# EAGLE design femto (EAGLE 6.4)
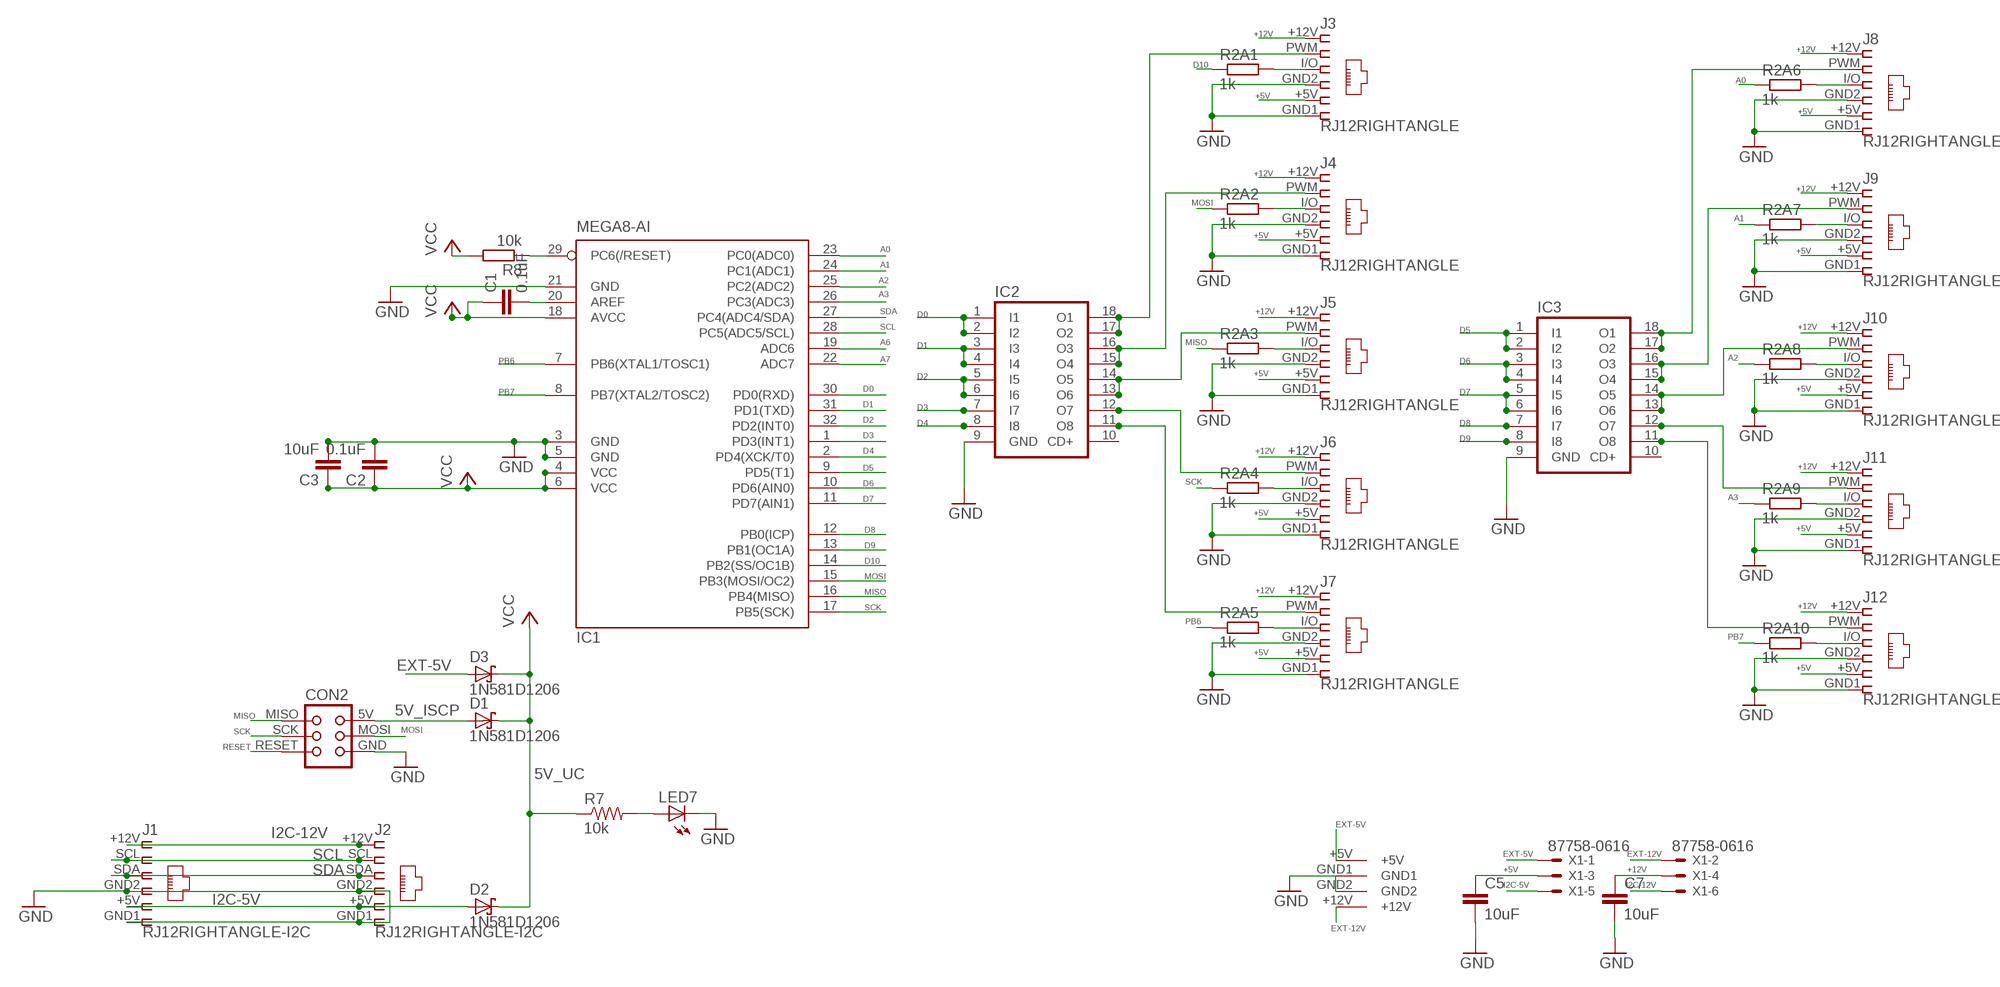
[diagram p0: schematic, sheet 1]

## Parts
C1  0.1uF  C-EUC1206  [C1206]
C2  0.1uF  C-EUC1206  [C1206]
C3  10uF  C-EUC1206  [C1206]
C5  10uF  C-EUC1206  [C1206]
C7  10uF  C-EUC1206  [C1206]
CON2  TINYISPTAG  [TC2030-MCP]
D1  1N581D1206  [LED-1206]
D2  1N581D1206  [LED-1206]
D3  1N581D1206  [LED-1206]
IC1  MEGA8-AI  [TQFP32-08]
IC2  ULN2803A  [SO18W]
IC3  ULN2803A  [SO18W]
J1  RJ12RIGHTANGLE-I2C  [RJ12-RIGHTANGLE-I2C]
J2  RJ12RIGHTANGLE-I2C  [RJ12-RIGHTANGLE-I2C]
J3  RJ12RIGHTANGLE  [RJ12-RIGHTANGLE]
J4  RJ12RIGHTANGLE  [RJ12-RIGHTANGLE]
J5  RJ12RIGHTANGLE  [RJ12-RIGHTANGLE]
J6  RJ12RIGHTANGLE  [RJ12-RIGHTANGLE]
J7  RJ12RIGHTANGLE  [RJ12-RIGHTANGLE]
J8  RJ12RIGHTANGLE  [RJ12-RIGHTANGLE]
J9  RJ12RIGHTANGLE  [RJ12-RIGHTANGLE]
J10  RJ12RIGHTANGLE  [RJ12-RIGHTANGLE]
J11  RJ12RIGHTANGLE  [RJ12-RIGHTANGLE]
J12  RJ12RIGHTANGLE  [RJ12-RIGHTANGLE]
LED7  LEDCHIP-LED0603  [CHIP-LED0603]
R2A1  1k  R-EU_M1206  [M1206]
R2A2  1k  R-EU_M1206  [M1206]
R2A3  1k  R-EU_M1206  [M1206]
R2A4  1k  R-EU_M1206  [M1206]
R2A5  1k  R-EU_M1206  [M1206]
R2A6  1k  R-EU_M1206  [M1206]
R2A7  1k  R-EU_M1206  [M1206]
R2A8  1k  R-EU_M1206  [M1206]
R2A9  1k  R-EU_M1206  [M1206]
R2A10  1k  R-EU_M1206  [M1206]
R7  10k  RESISTOR0603-RES  [0603-RES]
R8  10k  R-EU_M1206  [M1206]
U$1  KPJX-4S-S  [KPJX-4S-S]
X1  87758-0616  [87758-0616]

## Nets
5V_ISCP: CON2.5V(VCC) D1.A
5V_UC [power]: C1.1 C2.1 C3.1 D1.C D2.C D3.C IC1.4(VCC) IC1.6(VCC) IC1.18(AVCC) R7.1 R8.2 ; supply symbol labelled VCC
+5V [power]: C5.1 J3.+5V J4.+5V J5.+5V J6.+5V J7.+5V J8.+5V J9.+5V J10.+5V J11.+5V J12.+5V X1.3
+12V: C7.1 J3.+12V J4.+12V J5.+12V J6.+12V J7.+12V J8.+12V J9.+12V J10.+12V J11.+12V J12.+12V X1.4
A0: IC1.23(PC0(ADC0)) R2A6.1
A1: IC1.24(PC1(ADC1)) R2A7.1
A2: IC1.25(PC2(ADC2)) R2A8.1
A3: IC1.26(PC3(ADC3)) R2A9.1
A6: IC1.19(ADC6)
A7: IC1.22(ADC7)
D0: IC1.30(PD0(RXD)) IC2.1(I1) IC2.2(I2)
D1: IC1.31(PD1(TXD)) IC2.3(I3) IC2.4(I4)
D2: IC1.32(PD2(INT0)) IC2.5(I5) IC2.6(I6)
D3: IC1.1(PD3(INT1)) IC2.7(I7)
D4: IC1.2(PD4(XCK/T0)) IC2.8(I8)
D5: IC1.9(PD5(T1)) IC3.1(I1) IC3.2(I2)
D6: IC1.10(PD6(AIN0)) IC3.3(I3) IC3.4(I4)
D7: IC1.11(PD7(AIN1)) IC3.5(I5) IC3.6(I6)
D8: IC1.12(PB0(ICP)) IC3.7(I7)
D9: IC1.13(PB1(OC1A)) IC3.8(I8)
D10: IC1.14(PB2(SS/OC1B)) R2A1.1
EXT-5V [highpower]: D3.A U$1.+5V X1.1
EXT-12V [highpower]: U$1.+12V X1.2
GND [power]: C2.2 C3.2 C5.2 C7.2 CON2.GND IC1.3(GND) IC1.5(GND) IC1.21(GND) IC2.9(GND) IC3.9(GND) J1.GND1 J1.GND2 J2.GND1 J2.GND2 J3.GND1 J3.GND2 J4.GND1 J4.GND2 J5.GND1 J5.GND2 J6.GND1 J6.GND2 J7.GND1 J7.GND2 J8.GND1 J8.GND2 J9.GND1 J9.GND2 J10.GND1 J10.GND2 J11.GND1 J11.GND2 J12.GND1 J12.GND2 LED7.C U$1.GND1 U$1.GND2
I2C-5V [power]: D2.A J1.+5V J2.+5V X1.5
I2C-12V: J1.+12V J2.+12V X1.6
MISO: CON2.MISO IC1.16(PB4(MISO)) R2A3.1
MOSI: CON2.MOSI IC1.15(PB3(MOSI/OC2)) R2A2.1
N$2: J3.I/O R2A1.2
N$3: IC2.17(O2) IC2.18(O1) J3.PWM
N$4: C1.2 IC1.20(AREF)
N$5: IC2.15(O4) IC2.16(O3) J4.PWM
N$6: IC2.13(O6) IC2.14(O5) J5.PWM
N$9: J4.I/O R2A2.2
N$10: J5.I/O R2A3.2
N$11: IC2.12(O7) J6.PWM
N$12: J6.I/O R2A4.2
N$13: IC2.11(O8) J7.PWM
N$14: J7.I/O R2A5.2
N$15: LED7.A R7.2
N$18: IC3.17(O2) IC3.18(O1) J8.PWM
N$19: IC3.15(O4) IC3.16(O3) J9.PWM
N$20: IC3.13(O6) IC3.14(O5) J10.PWM
N$21: J8.I/O R2A6.2
N$22: J9.I/O R2A7.2
N$23: J10.I/O R2A8.2
N$24: IC3.12(O7) J11.PWM
N$25: J11.I/O R2A9.2
N$26: IC3.11(O8) J12.PWM
N$27: J12.I/O R2A10.2
PB6: IC1.7(PB6(XTAL1/TOSC1)) R2A5.1
PB7: IC1.8(PB7(XTAL2/TOSC2)) R2A10.1
RESET: CON2.RESET IC1.29(PC6(/RESET)) R8.1
SCK: CON2.SCK IC1.17(PB5(SCK)) R2A4.1
SCL [highpower]: IC1.28(PC5(ADC5/SCL)) J1.SCL J2.SCL
SDA [highpower]: IC1.27(PC4(ADC4/SDA)) J1.SDA J2.SDA
Unconnected: IC2.10(CD+) IC3.10(CD+)

## Library data of the parts
C1-C3 = resistor:C-EU: CAPACITOR, European symbol
C5 C7 = rcl:C-EU: CAPACITOR, European symbol
CON2 = lpatiny:TINYISP: CONNECTOR
D1-D3 = lpatiny:1N581*: 1.0A SCHOTTKY BARRIER RECTIFIER Source: http://www.diodes.com/datasheets/ds23001.pdf
IC1 = atmel:MEGA8: MICROCONTROLLER 8 Kbytes FLASH, 1 kbytes SRAM, 512 bytes EEPROM, USART, 6-channel 10 bit ADC, 2-channel 8 bit ADC Pin compatible with Atmega48, ATMega88, ATMega168 Source: avr.lbr; MPN: ATMEGA8-16AU; OC_FARNELL: 9171371; OC_NEWARK: 73M8863
IC2 IC3 = lpatiny:ULN2803A: DRIVER ARRAY
J1-J12 = lpatiny:RJ12: CORCOM Modular RJ Jacks No Shield Source: www.tycoelectronics.com .. ENG_DS_1654001_1099_RJ_L_0507.pdf
LED7 = adafruit:LED: LED OSRAM: - CHIPLED LG R971, LG N971, LY N971, LG Q971, LY Q971, LO R971, LY R971 LH N974, LH R974 LS Q976, LO Q976, LY Q976 LO Q996 - Hyper CHIPLED LW Q18S LB Q993, LB Q99A, LB R99A - SideLED LS A670, LO A670, LY A670, LG A670, LP A670 LB A673, LV A673, LT A673, LW A673 LH A674 LY A675 LS A676, LA A676, LO A676, LY A676, LW A676 LS A679, LY A679, LG A679 - Hyper Micro SIDELED® LS Y876, LA Y876, LO Y876, LY Y876 LT Y87S - SmartLED LW L88C, LW L88S LB L89C, LB L89S, LG L890 LS L89K, LO L89K, LY L89K LS L896, LA L896, LO L896, LY L896 - TOPLED LS T670, LO T670, LY T670, LG T670, LP T670 LSG T670, LSP T670, LSY T670, LOP T670, LYG T670 LG T671, LOG T671, LSG T671 LB T673, LV T673, LT T673, LW T673 LH T674 LS T676, LA T676, LO T676, LY T676, LB T676, LH T676, LSB T676, LW T676 LB T67C, LV T67C, LT T67C, LS T67K, LO T67K, LY T67K, LW E67C LS E67B, LA E67B, LO E67B, LY E67B, LB E67C, LV E67C, LT E67C LW T67C LS T679, LY T679, LG T679 LS T770, LO T770, LY T770, LG T770, LP T770 LB T773, LV T773, LT T773, LW T773 LH T774 LS E675, LA E675, LY E675, LS T675 LS T776, LA T776, LO T776, LY T776, LB T776 LHGB T686 LT T68C, LB T68C - Hyper Mini TOPLED® LB M676 - Mini TOPLED Santana® LG M470 LS M47K, LO M47K, LY M47K Source: http://www.osram.convergy.de/
R2A1-R2A10 R8 = resistor:R-EU_: RESISTOR, European symbol
R7 = SparkFun:RESISTOR: Resistor Basic schematic elements and footprints for 0603, 1206, and PTH resistors.
U$1 = lpatiny:KPJX-4S-S
X1 = con-molex:87758-0616: 6 Pin - 2mm Dual Row Single Wafer, Vertical T/H HDR Source: http://www.molex.com/pdm_docs/sd/877580616_sd.pdf; MPN: 87758-0616; OC_FARNELL: 7472323; OC_NEWARK: 25M5667

## Net classes
0 default: width 0.457 mm
1 power: width 0.457 mm
2 highpower: width 0.457 mm
3 fine: width 0.305 mm

## Board
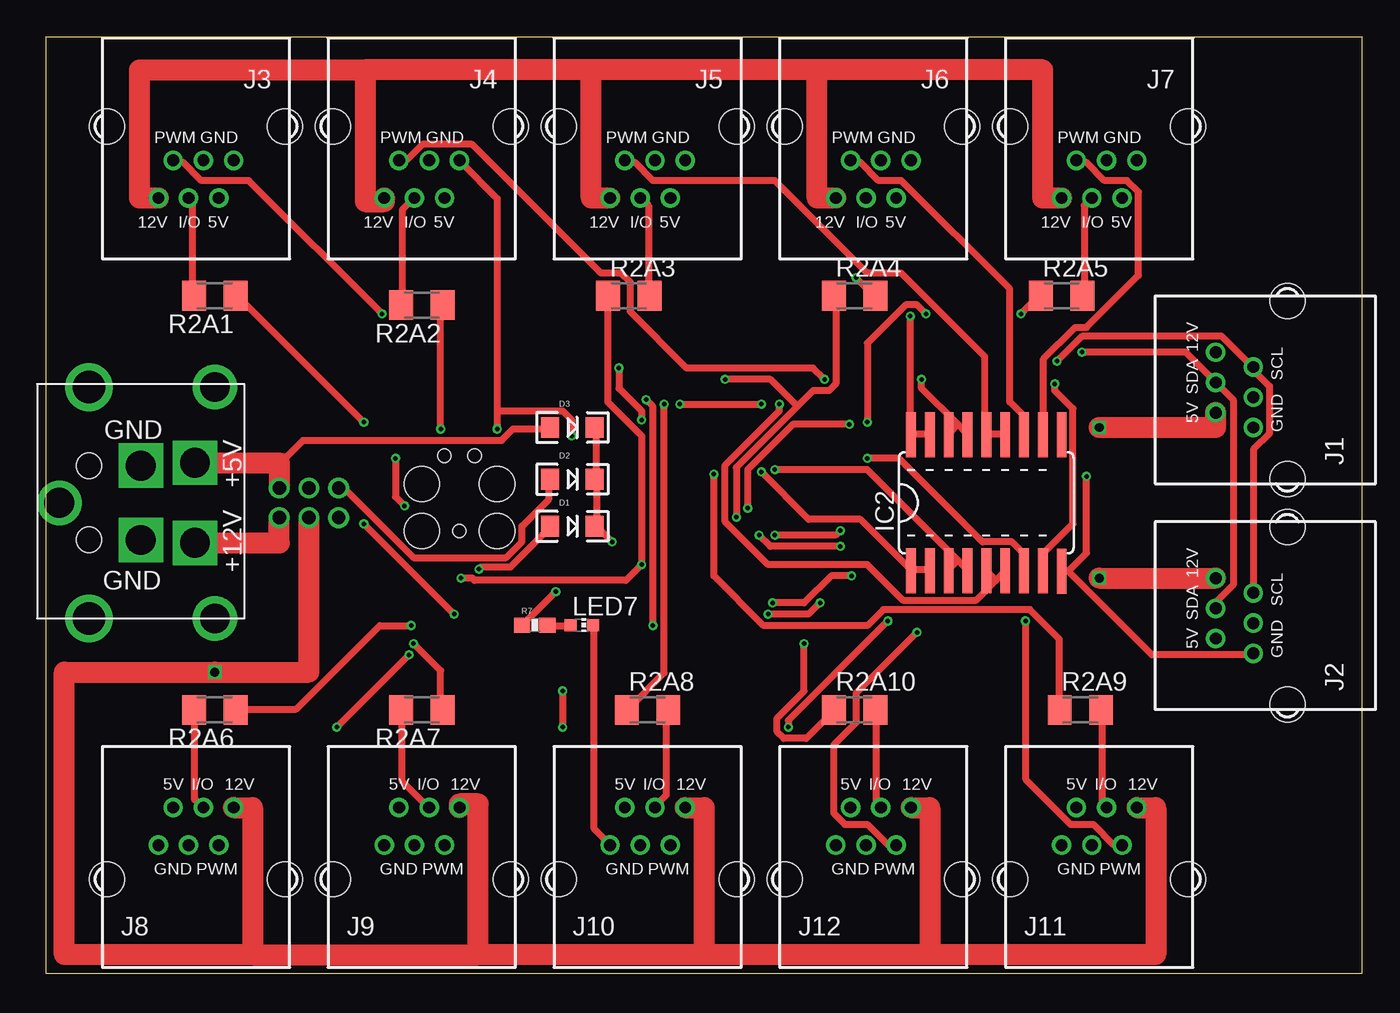
[diagram p1: board, top side]
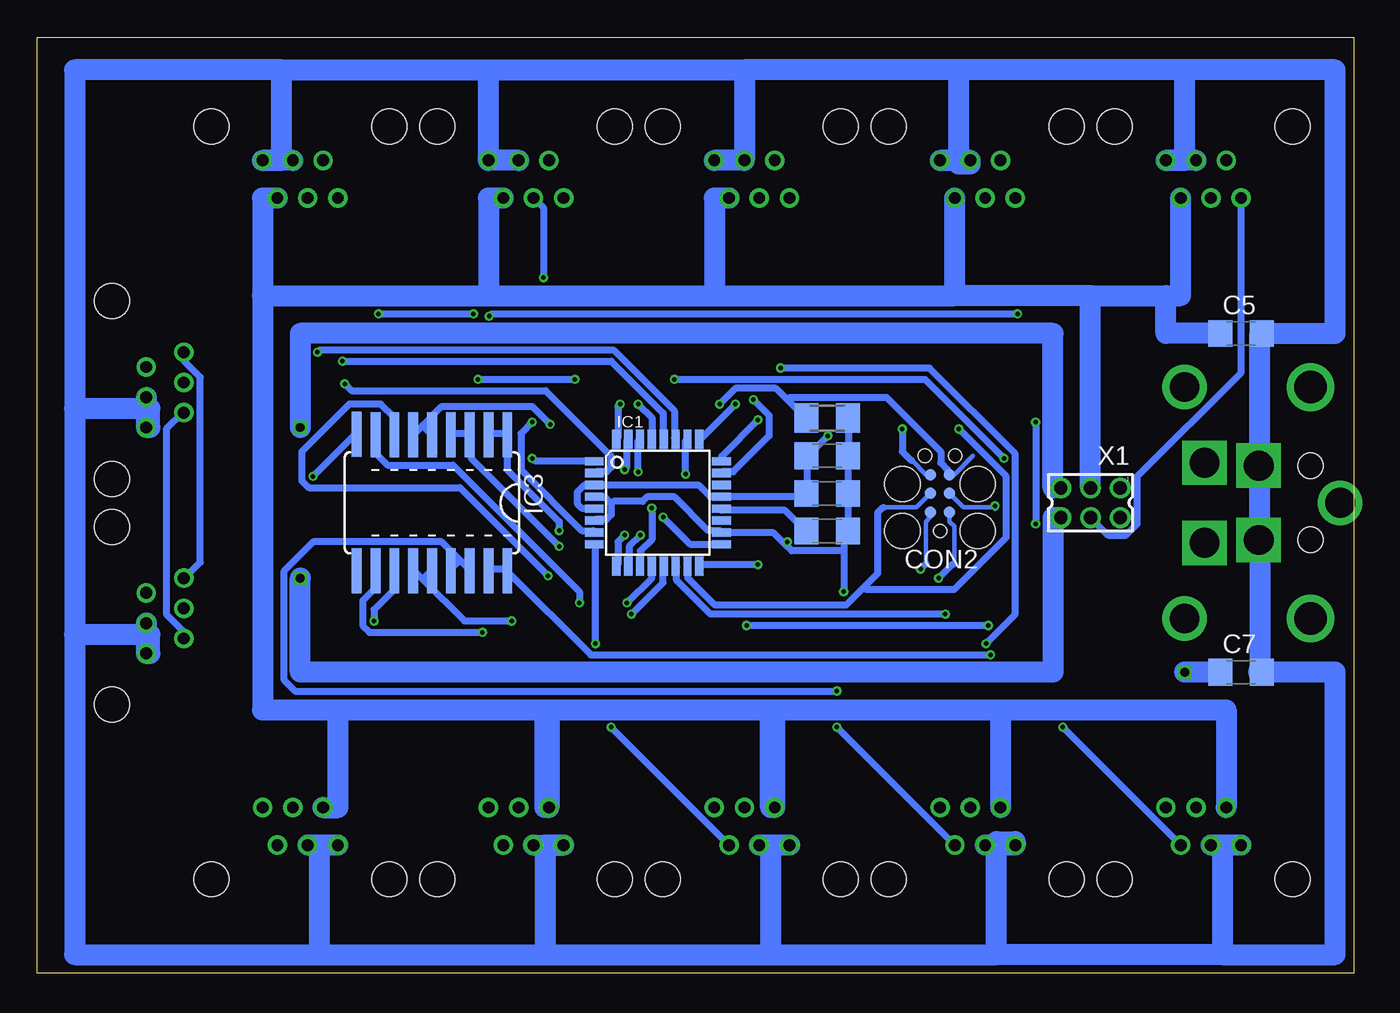
[diagram p2: board, bottom side, seen from below]

Size 88.89 x 63.17 mm. Coordinates in mm from the lower left corner, seen from the top.
Outline: 0,0 88.89,0 88.89,63.17 0,63.17 0,0
Copper layers (1*16): Top 0.035mm / dielectric 1.5mm / Bottom 0.035mm
Design rules "default": minimum track width 6mil, minimum drill 12mil, track to track 6mil, track to pad 6mil, pad to pad 6mil, via to via 6mil, smd to smd 0mil, copper to edge 10mil, drill to drill 10mil, minimum pad ring 10mil, minimum via ring 6mil, stop-mask expansion 2mil, vias tented up to drill 100mil, thermal gap 10mil
vRestrict: area 40.6,25.4 to 44.5,38.1; area 49.5,25.4 to 53.3,38.1; area 40.6,25.4 to 53.3,29.2; area 40.6,34.3 to 53.3,38.1; area 25.4,29.2 to 30.5,35.6; area 55.9,24.1 to 69.8,39.4

### Footprints (pad centres in the part's own frame; a part is rotated, then mirrored left to right if it is on the bottom)
C1206 = smd 1.6 x 1.8: 1 -1.4,0; 2 1.4,0
TC2030-MCP = smd 0.787 x 0.787: 5V 1.27,0.635; GND 3.81,0.635; MISO 1.27,-0.635; MOSI 2.54,0.635; RESET 3.81,-0.635; SCK 2.54,-0.635 | hole 0.889: 0,0; 5.08,-1.016; 5.08,1.016 | hole 2.375: 0,2.54; 0,-2.54; 3.175,-2.54; 3.175,2.54
LED-1206 = smd 1.2 x 1.4: A -1.5,0; C 1.5,0
TQFP32-08 = smd 1.27 x 0.559: 1 -4.293,2.8; 2 -4.293,2; 3 -4.293,1.2; 4 -4.293,0.4; 5 -4.293,-0.4; 6 -4.293,-1.2; 7 -4.293,-2; 8 -4.293,-2.8; 17 4.293,-2.8; 18 4.293,-2; 19 4.293,-1.2; 20 4.293,-0.4; 21 4.293,0.4; 22 4.293,1.2; 23 4.293,2; 24 4.293,2.8 | smd 0.559 x 1.27: 9 -2.8,-4.293; 10 -2,-4.293; 11 -1.2,-4.293; 12 -0.4,-4.293; 13 0.4,-4.293; 14 1.2,-4.293; 15 2,-4.293; 16 2.8,-4.293; 25 2.8,4.293; 26 2,4.293; 27 1.2,4.293; 28 0.4,4.293; 29 -0.4,4.293; 30 -1.2,4.293; 31 -2,4.293; 32 -2.8,4.293
SO18W = smd 0.66 x 3.048: 1 -5.08,-4.585; 2 -3.81,-4.585; 3 -2.54,-4.585; 4 -1.27,-4.585; 5 0,-4.585; 6 1.27,-4.585; 7 2.54,-4.585; 8 3.81,-4.585; 9 5.08,-4.623; 10 5.08,4.585; 11 3.81,4.585; 12 2.54,4.585; 13 1.27,4.585; 14 0,4.585; 15 -1.27,4.585; 16 -2.54,4.585; 17 -3.81,4.585; 18 -5.08,4.585
RJ12-RIGHTANGLE-I2C = drill 0.8 pad 1.3: +5V -1.54,4.84; +12V 2.54,4.84; GND1 -2.54,2.3; GND2 -0.5,2.3; SCL 1.54,2.3; SDA 0.5,4.84 | hole 2.36: -6,0; 6,0
RJ12-RIGHTANGLE = drill 0.8 pad 1.3: +5V -1.54,4.84; +12V 2.54,4.84; GND1 -2.54,2.3; GND2 -0.5,2.3; I/O 0.5,4.84; PWM 1.54,2.3 | hole 2.36: -6,0; 6,0
CHIP-LED0603 = smd 0.8 x 0.8: A 0,-0.75; C 0,0.75
M1206 = smd 1.6 x 2: 1 -1.4,0; 2 1.4,0
0603-RES = smd 1.1 x 1: 1 -0.85,0; 2 0.85,0
KPJX-4S-S = drill 2 square: +5V 2.7,1.35; +12V -2.7,1.35; GND1 -2.5,5; GND2 2.5,5 | drill 2: P$1 -7.8,0; P$2 7.8,0; P$11 0,10.5 | drill 2.2: P$3 -7.8,8.5; P$4 7.8,8.5 | hole 1.7: -2.5,8.5; 2.5,8.5
87758-0616 = drill 0.9 pad 1.27: 1 -2,-1; 2 -2,1; 3 0,-1; 4 0,1; 5 2,-1; 6 2,1

### Placement (x,y rotation side)
C1  35.56,29.84 180 bottom
C2  35.56,32.38 180 bottom
C3  35.56,34.92 180 bottom
C5  7.62,43.18 0 bottom
C7  7.62,20.32 0 bottom
CON2  27.94,29.84 90 bottom
D1  35.56,30.16 0 top
D2  35.56,33.34 0 top
D3  35.56,36.83 0 top
IC1  46.99,31.75 0 bottom
IC2  63.5,31.75 0 top
IC3  62.23,31.75 180 bottom
J1  83.82,39.37 90 top
J2  83.82,24.13 90 top
J3  10.16,57.15 180 top
J4  25.4,57.15 180 top
J5  40.64,57.15 180 top
J6  55.88,57.15 180 top
J7  71.12,57.15 180 top
J8  10.16,6.35 0 top
J9  25.4,6.35 0 top
J10  40.64,6.35 0 top
J11  71.12,6.35 0 top
J12  55.88,6.35 0 top
LED7  36.2,23.5 270 top
R2A1  11.43,45.72 180 top
R2A2  25.4,45.09 180 top
R2A3  39.37,45.72 0 top
R2A4  54.61,45.72 0 top
R2A5  68.58,45.72 0 top
R2A6  11.43,17.78 180 top
R2A7  25.4,17.78 180 top
R2A8  40.64,17.78 0 top
R2A9  69.85,17.78 0 top
R2A10  54.61,17.78 0 top
R7  33.02,23.5 0 top
R8  35.56,37.47 0 bottom
U$1  11.43,31.75 90 top
X1  17.78,31.75 180 bottom

### Tracks (layer width: path | path; a pad name or v marks a point on that pad's centre or on a via)
5V_ISCP  (via drill 0.3)
  Top 0.457: v29.26,27.28 29.41,27.43 31.39,27.43 33.98,30.02 D1.A
  Bottom 0.305: CON2.5V 28.57,30.8 28.89,30.48 28.89,27.62
  Bottom 0.457: v29.26,27.28 28.96,27.58 28.89,27.62
5V_UC  (via drill 0.3)
  Top 0.457: D3.C 37.19,36.73 37.19,33.53 D2.C 37.19,33.22 37.19,30.18 D1.C 37.34,30.02 v38.25,29.11 | v34.44,25.76 32.31,23.62 R7.1
  Bottom 0.457: R8.2 34.14,37.34 34.14,35.05 C3.1 34.14,34.75 34.14,32.61 C2.1 34.14,32.31 34.14,30.02 C1.1 34.29,29.72 34.44,29.57 34.44,28.5 | 50.14,31.7 50.14,30.94 50.44,30.63 51.21,30.63 IC1.6 | 50.14,31.7 50.6,32.16 51.21,32.16 IC1.4 | 34.44,28.5 v34.44,25.76 | 38.41,28.96 37.95,28.5 34.44,28.5 | 38.41,28.96 39.17,29.72 42.67,29.72 IC1.18 42.82,29.87 43.59,29.87 45.87,32.16 47.7,32.16 48.01,31.85 49.99,31.85 50.14,31.7 | v38.25,29.11 38.41,28.96
+5V
  Bottom 1.422: X1.3 17.78,45.72 | 17.78,45.72 12.7,45.72 | 12.7,45.72 11.7,45.72 J3.+5V | 17.78,45.72 26.94,45.72 | 26.94,45.72 J4.+5V | J5.+5V 43.18,52.31 43.18,45.72 | 43.18,45.72 26.94,45.72 | J6.+5V 58.42,52.31 58.42,45.72 | 58.42,45.72 43.18,45.72 | J7.+5V 73.66,52.31 73.66,45.72 | 73.66,45.72 58.42,45.72 | J11.+5V 68.58,11.19 68.58,17.78 | 68.58,17.78 54.61,17.78 | 54.61,17.78 54.34,17.78 | 54.34,17.78 J12.+5V 54.61,11.19 54.61,17.78 | 54.34,17.78 39.37,17.78 | 39.37,17.78 39.1,17.78 | 39.1,17.78 J10.+5V 39.37,11.19 39.37,17.78 | 39.1,17.78 23.86,17.78 | 23.86,17.78 J9.+5V | 23.86,17.78 8.62,17.78 J8.+5V | C5.1 12.7,43.18 12.7,45.72 | 73.66,45.72 73.66,17.78 68.58,17.78
+12V  (via drill 0.6)
  Top 1.422: 13.97,1.27 29.21,1.27 | 29.21,1.27 29.21,11.43 27.94,11.43 J9.+12V | J10.+12V 44.45,11.19 44.45,1.27 | 44.45,1.27 29.21,1.27 | J12.+12V 59.69,11.19 59.69,1.27 | 59.69,1.27 44.45,1.27 | J11.+12V 74.93,11.19 74.93,1.27 59.69,1.27 | J3.+12V 6.35,52.31 6.35,60.96 21.59,60.96 | 21.59,60.96 21.59,52.07 22.86,52.07 J4.+12V | J5.+12V 36.83,52.31 36.83,60.96 | 36.83,60.96 21.59,60.96 | J6.+12V 52.07,52.31 52.07,60.96 | 52.07,60.96 36.83,60.96 | J7.+12V 67.31,52.31 67.31,60.96 52.07,60.96 | J8.+12V 13.97,11.19 13.97,1.27 | 13.97,1.27 1.27,1.27 1.27,20.32 v11.43,20.32 17.78,20.32 X1.4
  Bottom 0.457: J3.+12V 7.62,40.54 14.63,33.53 14.63,30.33 15.39,29.57 16.61,29.57 17.68,30.63 X1.4
  Bottom 1.422: C7.1 v11.43,20.32
A0  (via drill 0.3)
  Top 0.457: v40.54,38.71 41,38.25 v41,23.47 | v24.69,23.47 22.55,23.47 16.92,17.83 12.95,17.83 R2A6.1
  Bottom 0.457: v40.54,38.71 39.47,37.64 39.47,36.27 41.91,33.83 42.67,33.83 IC1.23 | v24.69,23.47 v41,23.47
A1  (via drill 0.3)
  Top 0.457: v40.23,37.34 40.23,37.95 38.71,39.47 v38.71,40.84 | v24.84,22.25 26.67,20.42 26.67,17.83 R2A7.1
  Bottom 0.457: v40.23,37.34 42.67,34.9 42.67,34.59 IC1.24 | v38.71,40.84 28.65,40.84 22.86,35.05 22.86,24.23 v24.84,22.25
A2  (via drill 0.3)
  Top 0.457: v41.76,38.41 41.76,20.27 39.32,17.83 R2A8.1
  Bottom 0.457: v41.76,38.41 44.04,36.12 IC1.25
A3  (via drill 0.3)
  Top 0.457: v45.11,33.68 45.11,26.82 48.46,23.47 55.47,23.47 56.54,24.54 66.45,24.54 68.43,22.55 68.43,17.83 R2A9.1
  Bottom 0.457: v45.11,33.68 45.11,35.97 IC1.26
D0  (via drill 0.3)
  Top 0.457: v48.31,33.83 51.51,30.63 55.02,30.63 58.37,27.28 IC2.1 58.52,27.28 59.59,27.28 IC2.2
  Bottom 0.457: v48.31,33.83 48.31,35.97 IC1.30
D1  (via drill 0.3)
  Top 0.457: v49.23,33.98 55.47,33.98 61.57,27.89 | 61.57,27.89 62.18,27.28 IC2.4 | 61.57,27.89 60.96,27.28 IC2.3
  Bottom 0.457: v49.23,33.98 49.07,34.14 49.07,35.97 IC1.31
D2  (via drill 0.3)
  Top 0.457: v49.53,38.41 49.53,37.95 45.87,34.29 45.87,30.48 48.77,27.58 55.47,27.58 57.91,25.15 62.79,25.15 64.16,26.52 | 64.16,26.52 64.77,27.13 IC2.6 | 64.16,26.52 63.55,27.13 IC2.5
  Bottom 0.457: v49.53,38.41 49.68,38.25 49.68,36.12 IC1.32
D3  (via drill 0.3)
  Top 0.457: v55.47,34.75 57.61,34.75 63.25,29.11 65.23,29.11 65.99,28.35 65.99,27.28 IC2.7
  Bottom 0.457: v55.47,34.75 55.32,34.59 51.36,34.59 IC1.1
D4  (via drill 0.3)
  Top 0.457: v68.12,39.78 68.12,39.32 69.34,38.1 69.34,30.33 67.36,28.35 67.36,27.28 IC2.8
  Bottom 0.457: v68.12,39.78 67.67,39.32 54.56,39.32 50.14,34.9 50.14,34.14 50.44,33.83 51.21,33.83 IC1.2
D5  (via drill 0.3)
  Top 0.457: v49.23,29.57 53.34,29.57 v53.65,29.87
  Bottom 0.457: v49.23,29.57 49.68,29.11 49.68,27.58 IC1.9 | v53.65,29.87 53.65,30.48 57.15,33.98 IC3.1 57.3,36.42 58.37,36.42 IC3.2
D6  (via drill 0.3)
  Top 0.457: v48.16,29.57 48.92,28.8 v53.65,28.8
  Bottom 0.457: v48.16,29.57 48.92,28.8 48.92,27.58 IC1.10 | v53.65,28.8 59.59,34.75 59.59,36.27 IC3.3 59.89,36.42 60.96,36.42 IC3.4
D7  (via drill 0.3)
  Top 0.457: v47.4,31.39 47.4,33.98 50.44,37.03 v54.25,37.03
  Bottom 0.457: v47.4,31.39 47.4,29.26 48.16,28.5 48.16,27.58 IC1.11 | v54.25,37.03 55.47,38.25 61.57,38.25 62.87,36.96 | 62.87,36.96 63.4,36.42 IC3.6 | 62.87,36.96 62.33,36.42 IC3.5
D8  (via drill 0.3)
  Top 0.457: v49.07,24.99 51.21,24.99 53.03,26.82 v54.41,26.82
  Bottom 0.457: v49.07,24.99 47.4,26.67 47.4,27.43 IC1.12 | v54.41,26.82 60.35,32.77 70.56,32.77 71.02,33.22 71.02,35.2 67.82,38.41 65.68,38.41 64.77,37.49 IC3.7
D9  (via drill 0.3)
  Top 0.457: v48.77,24.23 51.51,24.23 v52.27,24.99
  Bottom 0.457: v48.77,24.23 46.63,26.36 46.63,27.43 IC1.13 | v52.27,24.99 52.27,25.76 60.81,34.29 65.23,34.29 65.99,35.05 65.99,36.27 IC3.8
D10  (via drill 0.3)
  Top 0.457: v21.49,30.33 v27.58,24.23 | v21.49,37.19 12.95,45.72 R2A1.1
  Bottom 0.457: v27.58,24.23 43.43,24.23 45.72,26.52 45.72,27.43 IC1.14 | v21.49,37.19 v21.49,30.33
EXT-5V
  Top 0.457: D3.A 33.98,36.73 31.55,36.73 30.79,35.97 17.37,35.97 16.31,34.9 15.78,34.45
  Top 1.422: U$1.+5V 15.78,34.45 X1.1
EXT-12V
  Top 1.422: U$1.+12V 15.78,29.05 X1.2
GND  (via drill 0.3)
  Top 0.457: LED7.C 37.03,23.47 37.03,9.75 38.1,8.69 J10.GND1 | 30.48,37.95 30.48,52.27 28.04,54.71 J4.GND1 | 30.48,37.95 v30.48,36.73 | 69.04,27.13 IC2.9 | 69.04,27.13 74.68,21.49 81.38,21.49 J2.GND1 | v70.26,33.53 70.26,28.35 69.04,27.13 | v35.51,36.27 35.51,37.34 34.9,37.95 30.48,37.95
  Bottom 0.305: CON2.GND 28.89,33.66 29.84,34.61
  Bottom 0.457: 51.36,31.39 IC1.5 51.51,31.39 52.12,31.39 52.43,31.7 52.43,32.46 51.97,32.92 51.36,32.92 IC1.3 51.05,32.92 44.2,32.92 43.43,32.16 42.98,32.16 IC1.21 | 42.82,32.16 IC1.21 | IC1.21 42.52,32.16 37.19,32.16 37.03,32.31 C2.2 36.88,32.61 36.88,34.9 C3.2 36.73,35.05 v35.51,36.27 | 67.36,36.42 IC3.9 67.51,36.27 v70.26,33.53 | v30.48,36.73 30.48,35.2 29.87,34.59 29.84,34.61 | C7.2 6.25,20.42 6.25,20.32 | U$1.GND2 6.55,34.29 6.35,34.29
  Bottom 1.422: J3.GND2 J3.GND1 11.43,54.85 11.43,60.96 | 11.43,60.96 26.67,60.96 | 26.67,54.85 26.67,54.61 25.9,54.61 J4.GND2 J4.GND1 26.67,54.85 | 26.67,54.85 26.67,60.96 | 26.67,60.96 41.14,60.96 | 41.14,60.96 J5.GND2 J5.GND1 | J6.GND2 J6.GND1 58.42,60.96 | 58.42,60.96 41.14,60.96 | 72.39,54.85 J7.GND2 J7.GND1 72.39,54.85 | 72.39,60.96 58.42,60.96 | 8.89,8.65 J8.GND2 J8.GND1 8.89,8.65 | 8.89,1.27 24.13,1.27 | 24.13,1.27 24.13,8.89 22.86,8.89 J9.GND1 J9.GND2 | J10.GND1 J10.GND2 39.37,8.65 39.37,1.27 | 39.37,1.27 24.13,1.27 | J12.GND2 J12.GND1 54.61,8.65 54.61,1.27 | 54.61,1.27 39.37,1.27 | J11.GND1 J11.GND2 69.85,8.65 69.85,1.27 | 69.85,1.27 54.61,1.27 | J2.GND2 J2.GND1 81.28,21.59 81.28,22.86 86.36,22.86 | 86.36,22.86 86.36,1.27 69.85,1.27 | J1.GND2 J1.GND1 81.28,36.83 81.28,38.1 86.36,38.1 | 86.36,38.1 86.36,22.86 | 72.39,54.85 72.39,60.96 | 72.39,60.96 86.36,60.96 86.36,38.1 | 8.89,8.65 8.89,1.27 | 8.89,1.27 1.27,1.27 1.27,20.32 C7.2 6.25,20.32 6.35,20.32 | 6.35,20.32 6.43,20.32 | 6.35,29.25 6.35,34.29 | 6.35,34.29 6.43,34.29 | 6.35,34.29 6.35,43.18 C5.2 1.27,43.18 1.27,60.96 11.43,60.96 | U$1.GND1 6.35,29.25 | 6.35,29.25 6.35,20.32
I2C-5V  (via drill 0.6)
  Top 0.457: D2.A 33.98,33.22 33.98,32 32.16,30.18 32.16,29.11 31.09,28.04 24.84,28.04 20.27,32.61 19.81,32.61 X1.5
  Top 1.422: v71.12,36.83 78.98,36.83 J1.+5V
  Bottom 0.457: J2.+5V 79.1,22.71 79.1,23.16 80.16,24.23 80.16,36.73 79.1,37.8 J1.+5V
  Bottom 1.422: X1.5 20.32,32.75 20.32,43.18 71.12,43.18 v71.12,36.83
I2C-12V  (via drill 0.6)
  Top 1.422: v71.12,26.67 J2.+12V
  Bottom 0.457: J1.+12V 78.94,41.91 78.94,41.3 77.88,40.23 77.88,27.74 78.94,26.67 J2.+12V
  Bottom 1.422: X1.6 20.32,30.75 20.32,20.32 71.12,20.32 v71.12,26.67
MISO  (via drill 0.3)
  Top 0.457: R2A3.1 37.95,45.72 37.95,38.56 40.23,36.27 v40.23,27.58 39.17,26.52 28.96,26.52 28.8,26.67 v28.04,26.67
  Bottom 0.305: CON2.MISO 27.3,30.48 26.99,30.16 26.99,27.62
  Bottom 0.457: v40.23,27.58 44.04,27.58 IC1.16 | v28.04,26.67 27.13,27.58 26.99,27.62
MOSI  (via drill 0.3)
  Top 0.457: v26.67,36.73 26.67,44.96 R2A2.1
  Bottom 0.305: CON2.MOSI 29.53,31.43 31.75,31.43
  Bottom 0.457: 33.07,26.06 32.16,26.98 32.16,31.09 31.85,31.39 31.75,31.43 | 33.07,26.06 34.29,24.84 43.13,24.84 44.96,26.67 44.96,27.43 IC1.15 | v26.67,36.73 23.47,33.53 23.47,29.41 26.98,25.91 32.92,25.91 33.07,26.06
N$2
  Top 0.457: R2A1.2 9.91,45.72 9.91,52.12 9.75,52.27 J3.I/O
N$3  (via drill 0.3)
  Top 0.457: v22.71,44.5 13.72,53.49 10.52,53.49 9.3,54.71 8.69,54.71 J3.PWM | v58.37,44.35 58.37,36.42 IC2.18 58.52,36.42 59.59,36.42 IC2.17
  Bottom 0.457: v22.71,44.5 58.22,44.5 v58.37,44.35
N$4
  Bottom 0.457: IC1.20 42.67,31.24 38.41,31.24 37.03,29.87 C1.2
N$5  (via drill 0.3)
  Top 0.457: v52.58,40.08 51.82,40.84 43.28,40.84 39.47,44.65 39.47,46.63 38.86,47.24 37.49,47.24 28.8,55.93 25.45,55.93 24.38,54.86 23.93,54.86 J4.PWM | v59.13,40.08 59.13,39.47 61.57,37.03 | 61.57,37.03 62.18,36.42 IC2.15 | 61.57,37.03 60.96,36.42 IC2.16
  Bottom 0.457: v59.13,40.08 v52.58,40.08
N$6
  Top 0.457: J5.PWM 39.17,54.71 39.78,54.71 41,53.49 49.23,53.49 55.47,47.24 57.76,47.24 63.4,41.6 63.4,36.42 IC2.14 63.7,36.42 64.77,36.42 IC2.13
N$9
  Top 0.457: R2A2.2 24.08,45.11 24.08,51.51 24.84,52.27 J4.I/O
N$10
  Top 0.457: R2A3.2 40.69,45.72 40.69,51.82 40.23,52.27 J5.I/O
N$11
  Top 0.457: J6.PWM 54.41,54.71 55.02,54.71 56.24,53.49 57.76,53.49 65.08,46.18 65.08,38.56 65.99,37.64 65.99,36.42 IC2.12
N$12  (via drill 0.3)
  Top 0.457: v54.71,46.94 55.93,45.72 R2A4.2
  Bottom 0.457: v54.71,46.94 54.71,51.66 55.32,52.27 J6.I/O
N$13
  Top 0.457: J7.PWM 69.65,54.71 70.26,54.71 71.48,53.49 73,53.49 73.76,52.73 73.76,47.09 70.26,43.59 69.49,43.59 67.36,41.45 67.36,36.42 IC2.11
N$14
  Top 0.457: R2A5.2 70.1,45.72 70.1,51.82 70.56,52.27 J7.I/O
N$15
  Top 0.457: LED7.A 35.36,23.47 33.98,23.47 R7.2
N$18  (via drill 0.3)
  Top 0.457: v24.54,21.49 v19.66,16.61
  Bottom 0.457: v19.66,16.61 11.73,8.69 J8.PWM | v24.54,21.49 51.51,21.49 57.15,27.13 IC3.18 57.3,27.28 58.37,27.28 IC3.17
N$19  (via drill 0.3)
  Top 0.457: v34.9,19.05 v34.9,16.61
  Bottom 0.457: v34.9,16.61 26.98,8.69 J9.PWM | v34.9,19.05 71.48,19.05 72.24,19.81 72.24,27.13 70.26,29.11 61.57,29.11 60.35,27.89 | 60.35,27.89 59.74,27.28 IC3.16 | 60.35,27.89 60.96,27.28 IC3.15
N$20  (via drill 0.3)
  Top 0.457: v50.14,16.61 50.14,17.07 v56.84,23.77
  Bottom 0.457: v50.14,16.61 42.22,8.69 J10.PWM | v56.84,23.77 60.05,23.77 62.87,26.59 | 62.87,26.59 63.4,27.13 IC3.13 | 62.87,26.59 62.33,27.13 IC3.14
N$21
  Top 0.457: R2A6.2 10.06,17.68 10.06,11.73 10.52,11.28 J8.I/O
N$22
  Top 0.457: R2A7.2 24.08,17.68 24.08,12.95 25.76,11.28 J9.I/O
N$23
  Top 0.457: R2A8.2 41.91,17.68 41.91,12.04 41.15,11.28 J10.I/O
N$24  (via drill 0.3)
  Top 0.457: v66.14,23.77 66.14,13.11 69.19,10.06 70.71,10.06 72.08,8.69 72.54,8.69 J11.PWM
  Bottom 0.457: v66.14,23.77 66.14,24.54 64.77,25.91 IC3.12
N$25
  Top 0.457: R2A9.2 71.32,17.68 71.32,11.43 71.48,11.28 J11.I/O
N$26  (via drill 0.3)
  Top 0.457: v58.83,23.01 54.71,18.9 54.71,16.92 53.19,15.39 53.19,10.82 53.95,10.06 55.47,10.06 56.84,8.69 57.3,8.69 J12.PWM
  Bottom 0.457: v58.83,23.01 66.45,23.01 66.9,23.47 66.9,25.15 66.14,25.91 66.14,27.13 IC3.11
N$27
  Top 0.457: R2A10.2 56.08,17.68 56.08,11.43 56.24,11.28 J12.I/O
PB6  (via drill 0.3)
  Top 0.457: v55.47,37.19 55.47,42.52 58.06,45.11 58.83,45.11 v59.44,44.5 | v65.84,44.5 67.06,45.72 R2A5.1
  Bottom 0.457: v55.47,37.19 56.24,36.42 56.24,33.98 52.12,29.87 51.36,29.87 IC1.7 | v65.84,44.5 v59.44,44.5
PB7  (via drill 0.3)
  Top 0.457: v51.21,22.25 51.21,19.05 49.38,17.22 49.38,16.31 49.84,15.85 51.36,15.85 53.19,17.68 R2A10.1
  Bottom 0.457: v51.21,22.25 51.21,28.8 IC1.8
RESET  (via drill 0.3)
  Top 0.457: v42.82,38.41 v48.31,38.41
  Bottom 0.305: CON2.RESET 26.99,33.66 25.72,34.92
  Bottom 0.457: v48.31,38.41 47.4,37.49 47.4,36.12 IC1.29 | v42.82,38.41 41.76,39.47 39.01,39.47 38.25,38.71 | 38.25,38.71 37.03,37.49 R8.1 | CON2.RESET 27.43,33.68 27.43,33.98 27.89,34.44 27.89,35.2 31.55,38.86 38.1,38.86 38.25,38.71
SCK  (via drill 0.3)
  Top 0.457: v46.63,30.79 46.63,34.14 50.75,38.25 | 50.75,38.25 51.82,39.32 52.88,39.32 53.34,39.78 53.34,45.72 R2A4.1 | v24.23,31.55 23.62,32.16 v23.62,34.75 | v45.87,40.08 48.92,40.08 50.75,38.25
  Bottom 0.305: CON2.SCK 26.35,31.43 24.23,31.43 24.13,31.43
  Bottom 0.457: v46.63,30.79 44.81,28.96 42.82,28.96 IC1.17 | v23.62,34.75 28.96,40.08 v45.87,40.08 | v24.23,31.55 24.23,31.43
SCL  (via drill 0.3)
  Top 0.457: v68.28,41.3 69.95,42.98 79.4,42.98 81.38,41 J1.SCL 81.53,40.69 82.6,39.62 82.6,36.42 81.53,35.36 81.53,25.76 J2.SCL
  Bottom 0.457: v68.28,41.3 50.14,41.3 46.63,37.8 46.63,36.12 IC1.28
SDA  (via drill 0.3)
  Top 0.457: v69.95,41.91 76.96,41.91 78.94,39.93 J1.SDA 79.1,39.78 80.16,38.71 80.16,26.21 79.1,25.15 79.1,24.69 J2.SDA
  Bottom 0.457: v69.95,41.91 69.8,42.06 49.99,42.06 45.87,37.95 45.87,36.12 IC1.27